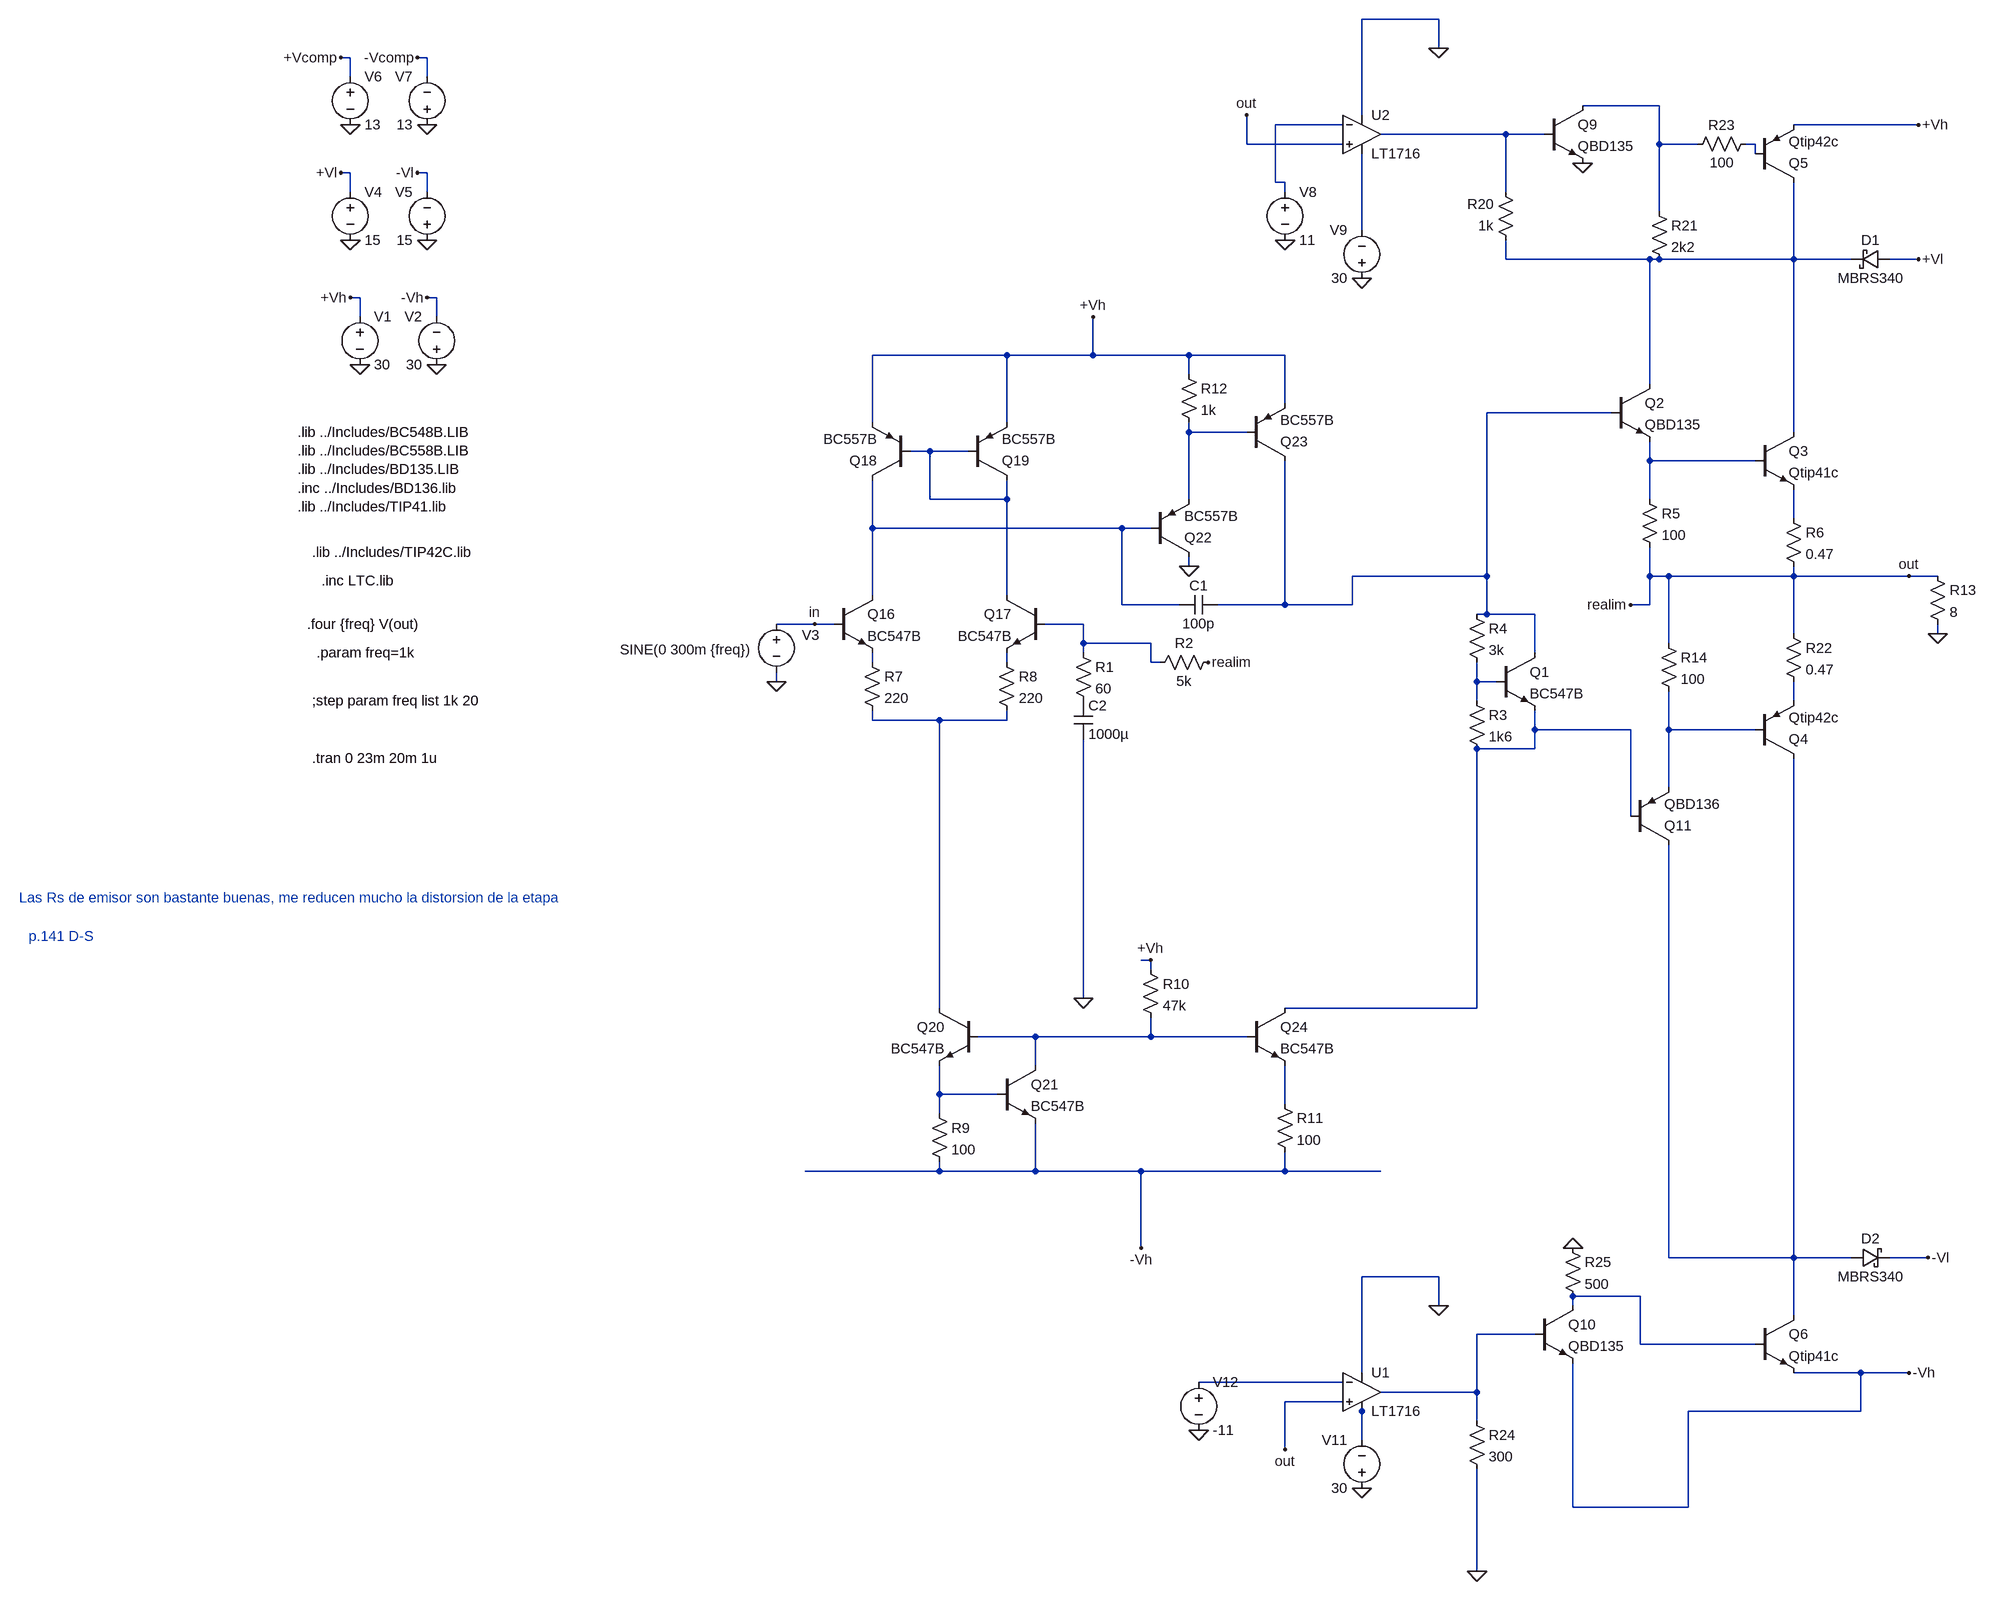
[diagram p0: schematic Intento etapa de entrada.asc]
Intento etapa de entrada.asc, the LTspice schematic file:
Version 4
SHEET 1 2628 1452
WIRE -624 -1248 -752 -1248
WIRE -624 -1200 -624 -1248
WIRE -2880 -1184 -2896 -1184
WIRE -2752 -1184 -2768 -1184
WIRE -2880 -1152 -2880 -1184
WIRE -2752 -1152 -2752 -1184
WIRE -256 -1104 -384 -1104
WIRE -752 -1088 -752 -1248
WIRE -784 -1072 -896 -1072
WIRE 176 -1072 -32 -1072
WIRE -512 -1056 -720 -1056
WIRE -448 -1056 -512 -1056
WIRE -944 -1040 -944 -1088
WIRE -784 -1040 -944 -1040
WIRE -256 -1040 -256 -1104
WIRE -192 -1040 -256 -1040
WIRE -96 -1040 -112 -1040
WIRE -96 -1024 -96 -1040
WIRE -2880 -992 -2896 -992
WIRE -2752 -992 -2768 -992
WIRE -896 -976 -896 -1072
WIRE -880 -976 -896 -976
WIRE -2880 -960 -2880 -992
WIRE -2752 -960 -2752 -992
WIRE -880 -960 -880 -976
WIRE -512 -960 -512 -1056
WIRE -256 -928 -256 -1040
WIRE -752 -896 -752 -1024
WIRE -512 -848 -512 -880
WIRE -272 -848 -512 -848
WIRE -256 -848 -272 -848
WIRE -32 -848 -32 -976
WIRE -32 -848 -256 -848
WIRE 64 -848 -32 -848
WIRE 176 -848 128 -848
WIRE -2864 -784 -2880 -784
WIRE -2736 -784 -2752 -784
WIRE -2864 -752 -2864 -784
WIRE -2736 -752 -2736 -784
WIRE -1344 -688 -1568 -688
WIRE -1200 -688 -1200 -752
WIRE -1200 -688 -1344 -688
WIRE -1040 -688 -1200 -688
WIRE -880 -688 -1040 -688
WIRE -1040 -656 -1040 -688
WIRE -272 -640 -272 -848
WIRE -880 -608 -880 -688
WIRE -336 -592 -544 -592
WIRE -1568 -576 -1568 -688
WIRE -1344 -576 -1344 -688
WIRE -1040 -560 -1040 -576
WIRE -944 -560 -1040 -560
WIRE -32 -560 -32 -848
WIRE -1472 -528 -1504 -528
WIRE -1408 -528 -1472 -528
WIRE -272 -512 -272 -544
WIRE -96 -512 -272 -512
WIRE -1472 -448 -1472 -528
WIRE -1344 -448 -1344 -480
WIRE -1344 -448 -1472 -448
WIRE -1040 -448 -1040 -560
WIRE -272 -448 -272 -512
WIRE -32 -416 -32 -464
WIRE -1568 -400 -1568 -480
WIRE -1152 -400 -1568 -400
WIRE -1104 -400 -1152 -400
WIRE -1040 -336 -1040 -352
WIRE -544 -320 -544 -592
WIRE -544 -320 -768 -320
WIRE -272 -320 -272 -368
WIRE -240 -320 -272 -320
WIRE -32 -320 -32 -336
WIRE -32 -320 -240 -320
WIRE 160 -320 -32 -320
WIRE 208 -320 160 -320
WIRE -1568 -288 -1568 -400
WIRE -1344 -288 -1344 -448
WIRE -1152 -272 -1152 -400
WIRE -1056 -272 -1152 -272
WIRE -880 -272 -880 -512
WIRE -880 -272 -992 -272
WIRE -768 -272 -768 -320
WIRE -768 -272 -880 -272
WIRE -272 -272 -272 -320
WIRE -272 -272 -304 -272
WIRE -544 -256 -544 -320
WIRE -544 -256 -560 -256
WIRE -464 -256 -544 -256
WIRE -1664 -240 -1728 -240
WIRE -1632 -240 -1664 -240
WIRE -1216 -240 -1280 -240
WIRE -32 -224 -32 -320
WIRE 208 -224 208 -240
WIRE -1216 -208 -1216 -240
WIRE -1104 -208 -1216 -208
WIRE -240 -208 -240 -320
WIRE -1216 -192 -1216 -208
WIRE -464 -192 -464 -256
WIRE -1568 -176 -1568 -192
WIRE -1344 -176 -1344 -192
WIRE -1104 -176 -1104 -208
WIRE -1088 -176 -1104 -176
WIRE -1728 -144 -1728 -160
WIRE -560 -144 -560 -176
WIRE -528 -144 -560 -144
WIRE -560 -112 -560 -144
WIRE -32 -112 -32 -144
WIRE -1568 -80 -1568 -96
WIRE -1456 -80 -1568 -80
WIRE -1344 -80 -1344 -96
WIRE -1344 -80 -1456 -80
WIRE -464 -64 -464 -96
WIRE -304 -64 -464 -64
WIRE -240 -64 -240 -128
WIRE -96 -64 -240 -64
WIRE -464 -32 -464 -64
WIRE -464 -32 -560 -32
WIRE -240 32 -240 -64
WIRE -304 80 -304 -64
WIRE -1104 320 -1120 320
WIRE -1104 336 -1104 320
WIRE -1216 384 -1216 -48
WIRE -1456 400 -1456 -80
WIRE -560 400 -560 -32
WIRE -560 400 -880 400
WIRE -1296 448 -1392 448
WIRE -1104 448 -1104 416
WIRE -1104 448 -1296 448
WIRE -944 448 -1104 448
WIRE -1296 496 -1296 448
WIRE -1456 544 -1456 496
WIRE -1360 544 -1456 544
WIRE -880 560 -880 496
WIRE -1456 576 -1456 544
WIRE -1456 672 -1456 656
WIRE -1456 672 -1680 672
WIRE -1296 672 -1296 592
WIRE -1296 672 -1456 672
WIRE -1120 672 -1296 672
WIRE -880 672 -880 640
WIRE -880 672 -1120 672
WIRE -720 672 -880 672
WIRE -1120 800 -1120 672
WIRE -240 816 -240 128
WIRE -32 816 -32 -16
WIRE -32 816 -240 816
WIRE 64 816 -32 816
WIRE 192 816 128 816
WIRE -624 848 -752 848
WIRE -288 880 -400 880
WIRE -624 896 -624 848
WIRE -400 896 -400 880
WIRE -32 912 -32 816
WIRE -464 944 -560 944
WIRE -288 960 -288 880
WIRE -96 960 -288 960
WIRE -752 1008 -752 848
WIRE 80 1008 -32 1008
WIRE 160 1008 80 1008
WIRE -784 1024 -1024 1024
WIRE -560 1040 -560 944
WIRE -560 1040 -720 1040
WIRE -784 1056 -880 1056
WIRE -752 1072 -752 1056
WIRE 80 1072 80 1008
WIRE 80 1072 -208 1072
WIRE -560 1088 -560 1040
WIRE -752 1120 -752 1072
WIRE -880 1136 -880 1056
WIRE -400 1232 -400 992
WIRE -208 1232 -208 1072
WIRE -208 1232 -400 1232
WIRE -560 1424 -560 1168
FLAG -1040 -336 0
FLAG -1120 800 -Vh
FLAG -1104 320 +Vh
FLAG -2864 -672 0
FLAG -2736 -672 0
FLAG -2880 -784 +Vh
FLAG -2752 -784 -Vh
FLAG -1728 -144 0
FLAG -1216 384 0
FLAG -1664 -240 in
FLAG -1008 -176 realim
FLAG -304 -272 realim
FLAG 208 -224 0
FLAG 160 -320 out
FLAG -2880 -880 0
FLAG -2752 -880 0
FLAG -2896 -992 +Vl
FLAG -2768 -992 -Vl
FLAG -2880 -1072 0
FLAG -2752 -1072 0
FLAG -2896 -1184 +Vcomp
FLAG -2768 -1184 -Vcomp
FLAG 176 -848 +Vl
FLAG 192 816 -Vl
FLAG 160 1008 -Vh
FLAG 176 -1072 +Vh
FLAG -1200 -752 +Vh
FLAG -880 -880 0
FLAG -624 -1200 0
FLAG -944 -1088 out
FLAG -752 -816 0
FLAG -624 896 0
FLAG -752 1200 0
FLAG -880 1136 out
FLAG -1024 1104 0
FLAG -400 800 0
FLAG -560 1424 0
FLAG -384 -1008 0
SYMBOL npn -1632 -288 R0
SYMATTR InstName Q16
SYMATTR Value BC547B
SYMBOL pnp -1504 -480 R180
SYMATTR InstName Q18
SYMATTR Value BC557B
SYMBOL res -1584 -192 R0
SYMATTR InstName R7
SYMATTR Value 220
SYMBOL res -1360 -192 R0
SYMATTR InstName R8
SYMATTR Value 220
SYMBOL res -1472 560 R0
SYMATTR InstName R9
SYMATTR Value 100
SYMBOL res -1120 320 R0
SYMATTR InstName R10
SYMATTR Value 47k
SYMBOL res -896 544 R0
SYMATTR InstName R11
SYMATTR Value 100
SYMBOL res -1056 -672 R0
SYMATTR InstName R12
SYMATTR Value 1k
SYMBOL voltage -2864 -768 R0
WINDOW 123 0 0 Left 2
WINDOW 39 0 0 Left 2
SYMATTR InstName V1
SYMATTR Value 30
SYMBOL voltage -2736 -656 R180
WINDOW 0 24 96 Left 2
WINDOW 3 24 16 Left 2
WINDOW 123 0 0 Left 2
WINDOW 39 0 0 Left 2
SYMATTR InstName V2
SYMATTR Value 30
SYMBOL npn -1280 -288 M0
SYMATTR InstName Q17
SYMATTR Value BC547B
SYMBOL npn -1392 400 M0
SYMATTR InstName Q20
SYMATTR Value BC547B
SYMBOL npn -1360 496 R0
SYMATTR InstName Q21
SYMATTR Value BC547B
SYMBOL npn -944 400 R0
SYMATTR InstName Q24
SYMATTR Value BC547B
SYMBOL pnp -1408 -480 M180
SYMATTR InstName Q19
SYMATTR Value BC557B
SYMBOL pnp -1104 -352 M180
SYMATTR InstName Q22
SYMATTR Value BC557B
SYMBOL pnp -944 -512 M180
SYMATTR InstName Q23
SYMATTR Value BC557B
SYMBOL voltage -1728 -256 R0
WINDOW 3 -261 59 Left 2
WINDOW 123 0 0 Left 2
WINDOW 39 0 0 Left 2
WINDOW 0 43 35 Left 2
SYMATTR Value SINE(0 300m {freq})
SYMATTR InstName V3
SYMBOL res -1232 -208 R0
SYMATTR InstName R1
SYMATTR Value 60
SYMBOL res -992 -192 R90
WINDOW 0 0 56 VBottom 2
WINDOW 3 32 56 VTop 2
SYMATTR InstName R2
SYMATTR Value 5k
SYMBOL cap -992 -288 R90
WINDOW 0 0 32 VBottom 2
WINDOW 3 32 32 VTop 2
SYMATTR InstName C1
SYMATTR Value 100p
SYMBOL cap -1232 -112 R0
SYMATTR InstName C2
SYMATTR Value 1000µ
SYMBOL res -576 -128 R0
SYMATTR InstName R3
SYMATTR Value 1k6
SYMBOL res -576 -272 R0
SYMATTR InstName R4
SYMATTR Value 3k
SYMBOL res -288 -464 R0
SYMATTR InstName R5
SYMATTR Value 100
SYMBOL npn -336 -640 R0
SYMATTR InstName Q2
SYMATTR Value QBD135
SYMBOL npn -96 -560 R0
SYMATTR InstName Q3
SYMATTR Value Qtip41c
SYMBOL res -48 -432 R0
SYMATTR InstName R6
SYMATTR Value 0.47
SYMBOL res -48 -240 R0
SYMATTR InstName R22
SYMATTR Value 0.47
SYMBOL pnp -304 128 M180
SYMATTR InstName Q11
SYMATTR Value QBD136
SYMBOL res 192 -336 R0
SYMATTR InstName R13
SYMATTR Value 8
SYMBOL npn -528 -192 R0
SYMATTR InstName Q1
SYMATTR Value BC547B
SYMBOL voltage -2880 -976 R0
WINDOW 123 0 0 Left 2
WINDOW 39 0 0 Left 2
SYMATTR InstName V4
SYMATTR Value 15
SYMBOL voltage -2752 -864 R180
WINDOW 0 24 96 Left 2
WINDOW 3 24 16 Left 2
WINDOW 123 0 0 Left 2
WINDOW 39 0 0 Left 2
SYMATTR InstName V5
SYMATTR Value 15
SYMBOL voltage -2880 -1168 R0
WINDOW 123 0 0 Left 2
WINDOW 39 0 0 Left 2
SYMATTR InstName V6
SYMATTR Value 13
SYMBOL voltage -2752 -1056 R180
WINDOW 0 24 96 Left 2
WINDOW 3 24 16 Left 2
WINDOW 123 0 0 Left 2
WINDOW 39 0 0 Left 2
SYMATTR InstName V7
SYMATTR Value 13
SYMBOL pnp -96 -16 M180
SYMATTR InstName Q4
SYMATTR Value Qtip42c
SYMBOL res -256 -224 R0
SYMATTR InstName R14
SYMATTR Value 100
SYMBOL schottky 64 832 R270
WINDOW 0 32 32 VTop 2
WINDOW 3 0 32 VBottom 2
SYMATTR InstName D2
SYMATTR Value MBRS340
SYMBOL pnp -96 -976 M180
SYMATTR InstName Q5
SYMATTR Value Qtip42c
SYMBOL npn -96 912 R0
SYMATTR InstName Q6
SYMATTR Value Qtip41c
SYMBOL schottky 128 -864 R90
WINDOW 0 0 32 VBottom 2
WINDOW 3 32 32 VTop 2
SYMATTR InstName D1
SYMATTR Value MBRS340
SYMBOL voltage -880 -976 R0
WINDOW 123 0 0 Left 0
WINDOW 39 0 0 Left 0
SYMATTR InstName V8
SYMATTR Value 11
SYMBOL res -496 -864 R180
WINDOW 0 36 76 Left 2
WINDOW 3 36 40 Left 2
SYMATTR InstName R20
SYMATTR Value 1k
SYMBOL npn -448 -1104 R0
SYMATTR InstName Q9
SYMATTR Value QBD135
SYMBOL res -272 -944 R0
SYMATTR InstName R21
SYMATTR Value 2k2
SYMBOL res -96 -1056 R90
WINDOW 0 0 56 VBottom 2
WINDOW 3 32 56 VTop 2
SYMATTR InstName R23
SYMATTR Value 100
SYMBOL voltage -752 -800 R180
WINDOW 0 24 96 Left 2
WINDOW 3 24 16 Left 2
WINDOW 123 0 0 Left 0
WINDOW 39 0 0 Left 0
SYMATTR InstName V9
SYMATTR Value 30
SYMBOL res -576 1072 R0
SYMATTR InstName R24
SYMATTR Value 300
SYMBOL voltage -752 1216 R180
WINDOW 0 24 96 Left 2
WINDOW 3 24 16 Left 2
WINDOW 123 0 0 Left 0
WINDOW 39 0 0 Left 0
SYMATTR InstName V11
SYMATTR Value 30
SYMBOL npn -464 896 R0
SYMATTR InstName Q10
SYMATTR Value QBD135
SYMBOL res -416 784 R0
SYMATTR InstName R25
SYMATTR Value 500
SYMBOL voltage -1024 1008 R0
WINDOW 123 0 0 Left 0
WINDOW 39 0 0 Left 0
SYMATTR InstName V12
SYMATTR Value -11
SYMBOL Comparators\\LT1716 -752 1040 R0
SYMATTR InstName U1
SYMBOL Comparators\\LT1716 -752 -1056 R0
SYMATTR InstName U2
TEXT -3432 216 Left 2 ;Las Rs de emisor son bastante buenas, me reducen mucho la distorsion de la etapa
TEXT -3416 280 Left 2 ;p.141 D-S
TEXT -2944 -16 Left 2 !.tran 0 23m 20m 1u
TEXT -2952 -240 Left 2 !.four {freq} V(out)
TEXT -2968 -560 Left 2 !.lib ../Includes/BC548B.LIB\n.lib ../Includes/BC558B.LIB\n.lib ../Includes/BD135.LIB\n.inc ../Includes/BD136.lib\n.lib ../Includes/TIP41.lib
TEXT -2944 -112 Left 2 !;step param freq list 1k 20
TEXT -2936 -192 Left 2 !.param freq=1k
TEXT -2944 -360 Left 2 !.lib ../Includes/TIP42C.lib
TEXT -2928 -312 Left 2 !.inc LTC.lib

The netlist it stands for:
* Intento etapa de entrada.asc
Q16 N012 in N014 0 BC547B
Q18 N012 N009 +Vh 0 BC557B
R7 N014 N018 220
R8 N015 N018 220
R9 N022 -Vh 100
R10 +Vh N021 47k
R11 N023 -Vh 100
R12 +Vh N008 1k
V1 +Vh 0 30
V2 0 -Vh 30
Q17 N009 N013 N015 0 BC547B
Q20 N018 N021 N022 0 BC547B
Q21 N021 N022 -Vh 0 BC547B
Q24 N019 N021 N023 0 BC547B
Q19 N009 N009 +Vh 0 BC557B
Q22 0 N012 N008 0 BC557B
Q23 N007 N008 +Vh 0 BC557B
V3 in 0 SINE(0 300m {freq})
R1 N013 P001 60
R2 out N013 5k
C1 N007 N012 100p
C2 P001 0 1000µ
R3 N016 N019 1k6
R4 N007 N016 3k
R5 N010 out 100
Q2 N006 N007 N010 0 QBD135
Q3 N006 N010 N011 0 Qtip41c
R6 N011 out 0.47
R22 out N017 0.47
Q11 N024 N019 N020 0 QBD136
R13 out 0 8
Q1 N007 N016 N019 0 BC547B
V4 +Vl 0 15
V5 0 -Vl 15
V6 +Vcomp 0 13
V7 0 -Vcomp 13
Q4 N024 N020 N017 0 Qtip42c
R14 out N020 100
D2 N024 -Vl MBRS340
Q5 N006 N004 +Vh 0 Qtip42c
Q6 N024 N025 -Vh 0 Qtip41c
D1 +Vl N006 MBRS340
V8 N002 0 11
R20 N006 N003 1k
Q9 N001 N003 0 0 QBD135
R21 N001 N006 2k2
R23 N004 N001 100
V9 0 N005 30
R24 N026 0 300
V11 0 N028 30
Q10 N025 N026 -Vh 0 QBD135
R25 0 N025 500
V12 N027 0 -11
XU1 out N027 0 N028 N026 LT1716  ; pins In+ In- V+ V- OUT
XU2 out N002 0 N005 N003 LT1716  ; pins In+ In- V+ V- OUT
.model D D
.lib standard.dio
.model NPN NPN
.model PNP PNP
.lib standard.bjt
* Las Rs de emisor son bastante buenas, me reducen mucho la distorsion de la etapa
* p.141 D-S
.tran 0 23m 20m 1u
.four {freq} V(out)
.lib ../Includes/BC548B.LIB
.lib ../Includes/BC558B.LIB
.lib ../Includes/BD135.LIB
.inc ../Includes/BD136.lib
.lib ../Includes/TIP41.lib
;step param freq list 1k 20
.param freq=1k
.lib ../Includes/TIP42C.lib
.inc LTC.lib
.lib LTC1.lib
.backanno
.end